# EAGLE design atari2600-simplest-cart (EAGLE 9.6.2)
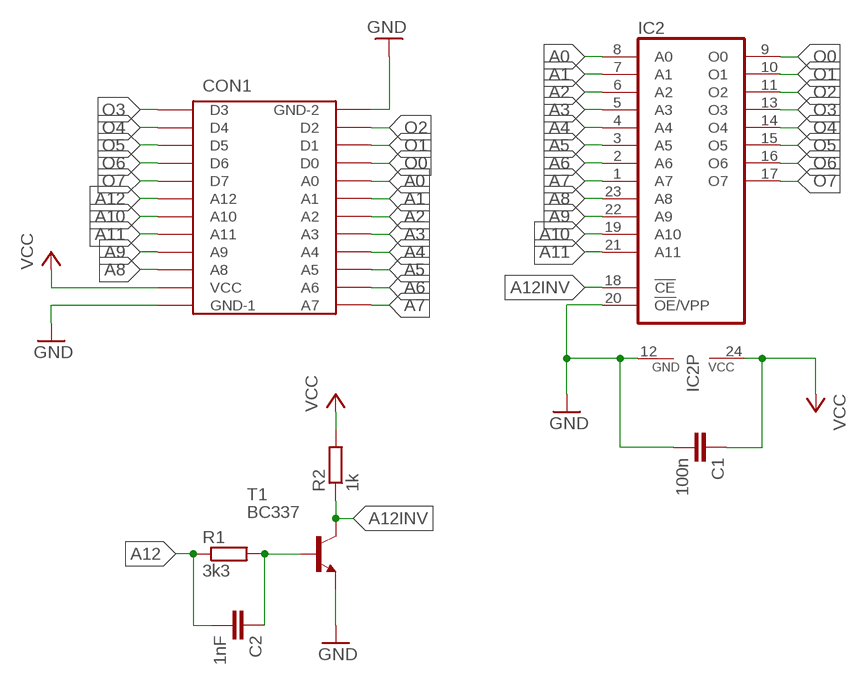
[diagram p0: schematic, sheet 1]

## Parts
C1  100n  C-EU025-025X050  [C025-025X050]
C2  1nF  C-EU025-025X050  [C025-025X050]
CON1  24PINEDGE-ATARI-2600  [24PINEDGE-ATARI-2600]
IC2  2732  [DIL24]
R1  3k3  R-EU_0204/7  [0204/7]
R2  1k  R-EU_0204/7  [0204/7]
T1  BC337  [TO92]

## Nets
A0: CON1.20(A0) IC2.8(A0)
A1: CON1.19(A1) IC2.7(A1)
A2: CON1.18(A2) IC2.6(A2)
A3: CON1.17(A3) IC2.5(A3)
A4: CON1.16(A4) IC2.4(A4)
A5: CON1.15(A5) IC2.3(A5)
A6: CON1.14(A6) IC2.2(A6)
A7: CON1.13(A7) IC2.1(A7)
A8: CON1.10(A8) IC2.23(A8)
A9: CON1.9(A9) IC2.22(A9)
A10: CON1.7(A10) IC2.19(A10)
A11: CON1.8(A11) IC2.21(A11)
A12: C2.2 CON1.6(A12) R1.1
A12INV: IC2.18(!CE) R2.1 T1.3(C)
GND: C1.2 CON1.12(GND-1) CON1.24(GND-2) IC2.12(GND) IC2.20(!OE!/VPP) T1.1(E)
N$2: C2.1 R1.2 T1.2(B)
O0: CON1.21(D0) IC2.9(O0)
O1: CON1.22(D1) IC2.10(O1)
O2: CON1.23(D2) IC2.11(O2)
O3: CON1.1(D3) IC2.13(O3)
O4: CON1.2(D4) IC2.14(O4)
O5: CON1.3(D5) IC2.15(O5)
O6: CON1.4(D6) IC2.16(O6)
O7: CON1.5(D7) IC2.17(O7)
VCC [wider]: C1.1 CON1.11(VCC) IC2.24(VCC) R2.2

## Library data of the parts
C1 C2 = rcl:C-EU: CAPACITOR, European symbol; SPICEPREFIX: C
CON1 = con-edge:24PINEDGE-ATARI-2600: 24 PIN EDGE CONNECTOR 2.54mm ATARI 2600 CARTRIDGE PORT
IC2 = memory:2732: MEMORY
R1 R2 = rcl:R-EU_: RESISTOR, European symbol; SPICEPREFIX: R
T1 = transistor:BC337: NPN TRANSISTOR

## Net classes
1 wider: width 0.508 mm

## Board
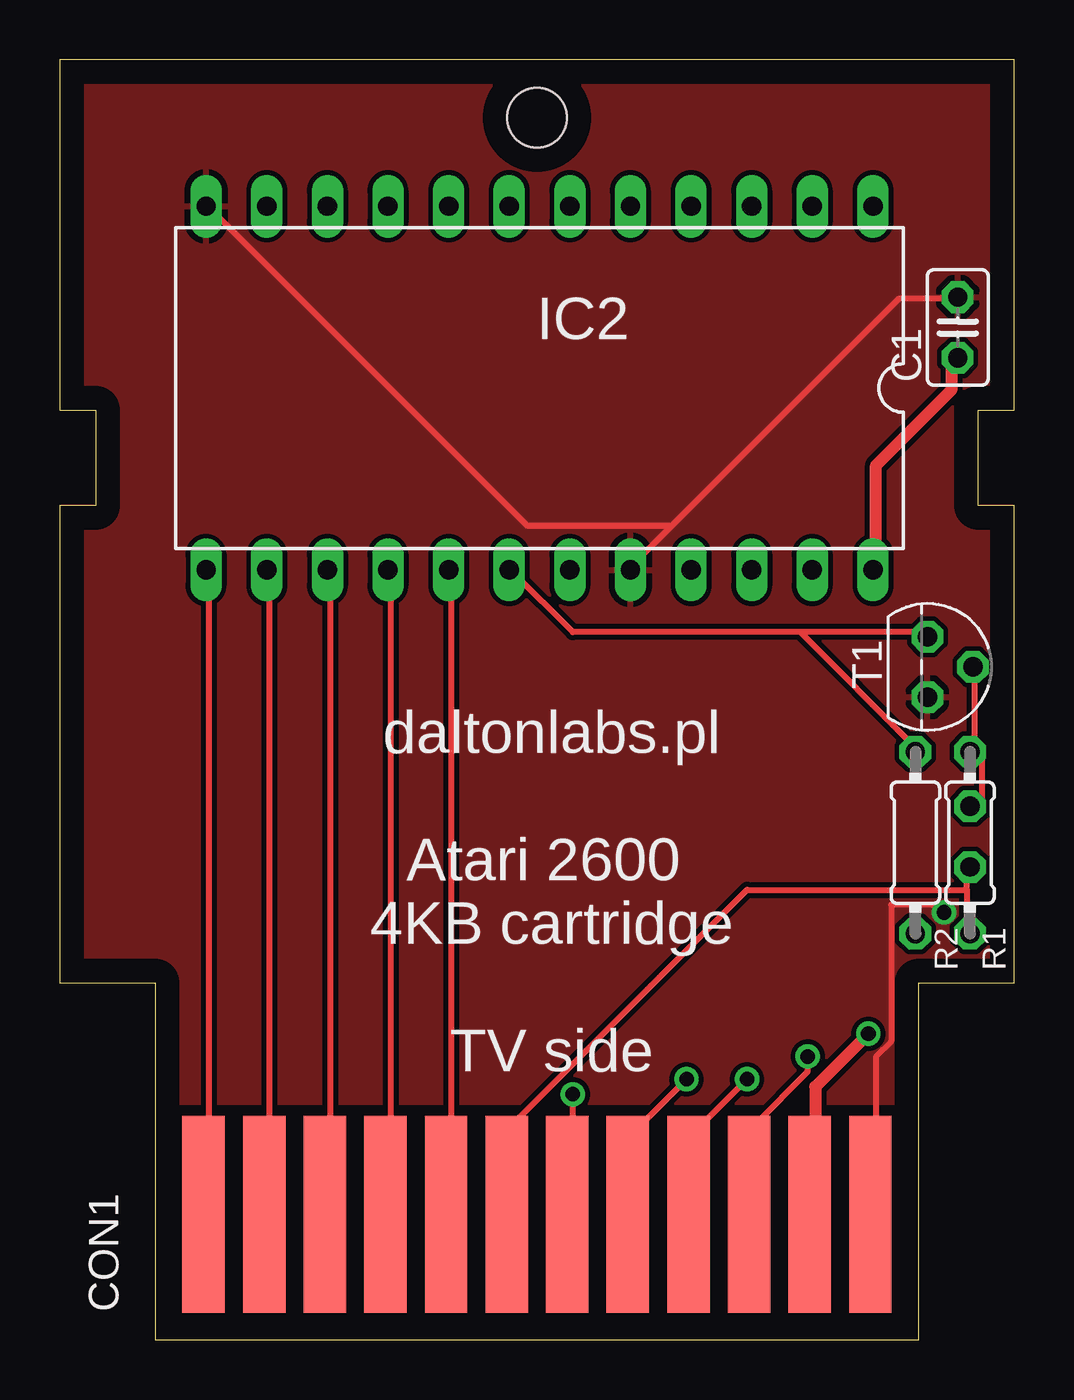
[diagram p1: board, top side]
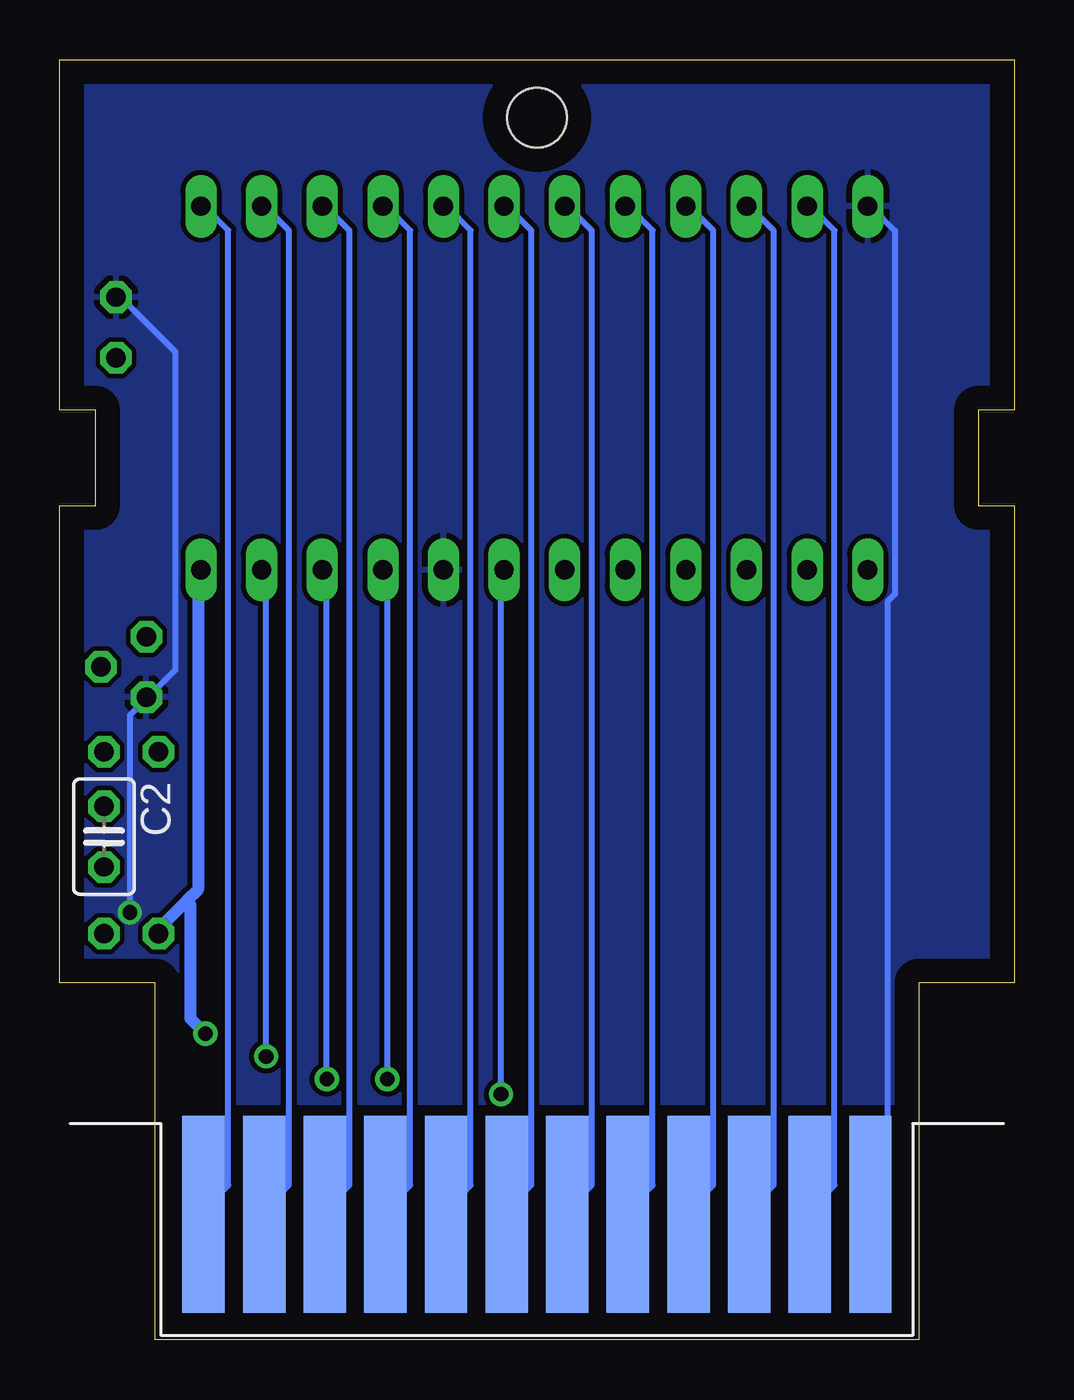
[diagram p2: board, bottom side, seen from below]

Size 40 x 53.64 mm. Coordinates in mm from the lower left corner, seen from the top.
Outline: 4,0 36,0 36,14.95 40,14.95 40,34.95 38.5,34.95 38.5,38.95 40,38.95 40,53.64 0,53.64 0,38.95 1.5,38.95 1.5,34.95 0,34.95 0,14.95 4,14.95 4,0
Copper layers (1*16): Top 0.035mm / dielectric 1.5mm / Bottom 0.035mm
Design rules "default": minimum track width 10mil, minimum drill 24mil, track to track 8mil, track to pad 8mil, pad to pad 8mil, via to via 8mil, smd to smd 8mil, copper to edge 40mil, drill to drill 8mil, minimum pad ring 10mil, minimum via ring 8mil, stop-mask expansion 4mil, vias tented up to drill 0mil, thermal gap 10mil
Holes 2.5 mm at 20,51.21

### Footprints (pad centres in the part's own frame; a part is rotated, then mirrored left to right if it is on the bottom)
C025-025X050 = drill 0.813 octagon: 1 -1.27,0; 2 1.27,0
24PINEDGE-ATARI-2600 = smd 1.778 x 8.255: 1 -13.97,0; 2 -11.43,0; 3 -8.89,0; 4 -6.35,0; 5 -3.81,0; 6 -1.27,0; 7 1.27,0; 8 3.81,0; 9 6.35,0; 10 8.89,0; 11 11.43,0; 12 13.97,0 | smd 1.778 x 8.255 bottom: 13 13.97,0; 14 11.43,0; 15 8.89,0; 16 6.35,0; 17 3.81,0; 18 1.27,0; 19 -1.27,0; 20 -3.81,0; 21 -6.35,0; 22 -8.89,0; 23 -11.43,0; 24 -13.97,0
DIL24 = drill 0.813 long: 1 -13.97,-7.62; 2 -11.43,-7.62; 3 -8.89,-7.62; 4 -6.35,-7.62; 5 -3.81,-7.62; 6 -1.27,-7.62; 7 1.27,-7.62; 8 3.81,-7.62; 9 6.35,-7.62; 10 8.89,-7.62; 11 11.43,-7.62; 12 13.97,-7.62; 13 13.97,7.62; 14 11.43,7.62; 15 8.89,7.62; 16 6.35,7.62; 17 3.81,7.62; 18 1.27,7.62; 19 -1.27,7.62; 20 -3.81,7.62; 21 -6.35,7.62; 22 -8.89,7.62; 23 -11.43,7.62; 24 -13.97,7.62
0204/7 = drill 0.813 octagon: 1 -3.81,0; 2 3.81,0
TO92 = drill 0.813 octagon: 1 1.27,0; 2 0,1.905; 3 -1.27,0

### Placement (x,y rotation side)
C1  37.63,42.42 90 top
C2  38.14,21.08 270 bottom
CON1  20,5.25 0 top
IC2  20.11,39.88 180 top
R1  38.14,20.83 90 top
R2  35.86,20.83 270 top
T1  36.36,28.19 270 top

### Tracks (layer width: path | path; a pad name or v marks a point on that pad's centre or on a via)
A0
  Bottom 0.254: IC2.8 16.11,47.43 15.16,46.48 15.16,6.48 16.11,5.52 CON1.20
A1
  Bottom 0.254: IC2.7 18.65,47.43 17.7,46.48 17.7,6.48 18.65,5.52 CON1.19
A2
  Bottom 0.254: IC2.6 21.19,47.43 20.23,46.48 20.23,6.48 21.19,5.52 CON1.18
A3
  Bottom 0.254: IC2.5 23.73,47.43 22.77,46.48 22.77,6.48 23.73,5.52 CON1.17
A4
  Bottom 0.254: IC2.4 26.27,47.43 25.31,46.48 25.31,6.48 26.27,5.52 CON1.16
A5
  Bottom 0.254: IC2.3 28.81,47.43 27.85,46.48 27.85,6.48 28.81,5.52 CON1.15
A6
  Bottom 0.254: IC2.2 31.35,47.43 30.4,46.48 30.4,6.48 31.35,5.52 CON1.14
A7
  Bottom 0.254: IC2.1 33.89,47.43 32.94,46.48 32.94,6.48 33.89,5.52 CON1.13
A8  (via drill 0.61)
  Top 0.254: v31.35,11.87 31.35,11.24 29.12,9.02 29.12,5.52 CON1.10
  Bottom 0.254: v31.35,11.87 31.35,32.19 IC2.23
A9  (via drill 0.61)
  Top 0.254: v28.81,10.92 26.59,8.7 26.59,5.52 CON1.9
  Bottom 0.254: v28.81,10.92 28.81,32.19 IC2.22
A10  (via drill 0.61)
  Top 0.254: v21.51,10.29 21.51,5.52 CON1.7
  Bottom 0.254: v21.51,10.29 21.51,32.19 IC2.19
A11  (via drill 0.61)
  Top 0.254: v26.27,10.92 24.05,8.7 24.05,5.52 CON1.8
  Bottom 0.254: v26.27,10.92 26.27,32.19 IC2.21
A12
  Top 0.254: 38.02,18.86 38.02,18.54 38.02,17.27 R1.1 | 38.02,18.86 28.81,18.86 18.97,9.02 18.97,5.52 CON1.6 | 38.02,18.86 38.02,19.81 C2.2
A12INV
  Top 0.254: 31.03,29.66 36.11,29.66 T1.3 | 31.03,29.66 21.51,29.66 18.97,32.19 IC2.18 | 31.03,29.66 35.79,24.89 R2.1
GND  (via drill 0.61)
  Top 0.254: 25.63,34.1 35.16,43.62 37.38,43.62 C1.2 | 25.63,34.1 24.05,32.51 IC2.20 | 25.63,34.1 19.6,34.1 6.27,47.43 IC2.12 | v37.06,17.91 36.74,18.23 34.84,18.23 34.84,12.51 34.2,11.87 34.2,5.52 CON1.12
  Bottom 0.254: C1.2 37.38,43.62 35.16,41.4 35.16,28.07 36.11,27.12 T1.1 36.43,26.8 37.06,26.16 v37.06,17.91 | CON1.24 5.95,5.52 5.31,6.16 5.31,30.92 5,31.24 5,46.48 5.95,47.43 IC2.12
  pour Top: -0.47,53.85 40.68,53.85 40.68,9.91 -0.72,9.91 -0.72,53.59
  pour Bottom: -0.97,54.1 40.94,54.1 40.94,10.16 40.68,9.91 -1.23,9.91 -1.23,53.85
N$2
  Top 0.254: T1.2 38.33,28.07 38.33,24.89 R1.2 38.65,24.26 38.65,22.35 C2.1
O0
  Bottom 0.254: IC2.9 13.57,47.43 12.61,46.48 12.61,6.48 13.57,5.52 CON1.21
O1
  Bottom 0.254: IC2.10 11.03,47.43 10.07,46.48 10.07,6.48 11.03,5.52 CON1.22
O2
  Bottom 0.254: IC2.11 8.49,47.43 7.54,46.48 7.54,6.48 8.49,5.52 CON1.23
O3
  Top 0.254: IC2.13 6.27,32.19 6.27,5.52 CON1.1
O4
  Top 0.254: IC2.14 8.8,32.19 8.8,5.52 CON1.2
O5
  Top 0.254: IC2.15 11.34,32.19 11.34,5.52 CON1.3
O6
  Top 0.254: IC2.16 13.88,32.19 13.88,5.52 CON1.4
O7
  Top 0.254: IC2.17 16.42,32.19 16.42,5.52 CON1.5
VCC  (via drill 0.61)
  Top 0.508: C1.1 37.38,41.09 37.38,39.81 34.2,36.64 34.2,32.51 IC2.24 | v33.89,12.83 31.66,10.6 31.66,5.52 CON1.11
  Bottom 0.508: 34.68,18.38 34.2,18.86 34.2,32.19 IC2.24 | 34.68,18.38 35.79,17.27 R2.2 | v33.89,12.83 34.52,13.46 34.52,18.23 34.68,18.38

### Text on the board
tNames: daltonlabs.pl / / Atari 2600 / 4KB cartridge / / TV side